# EAGLE design TVHR-PFG01 (EAGLE 6.0)
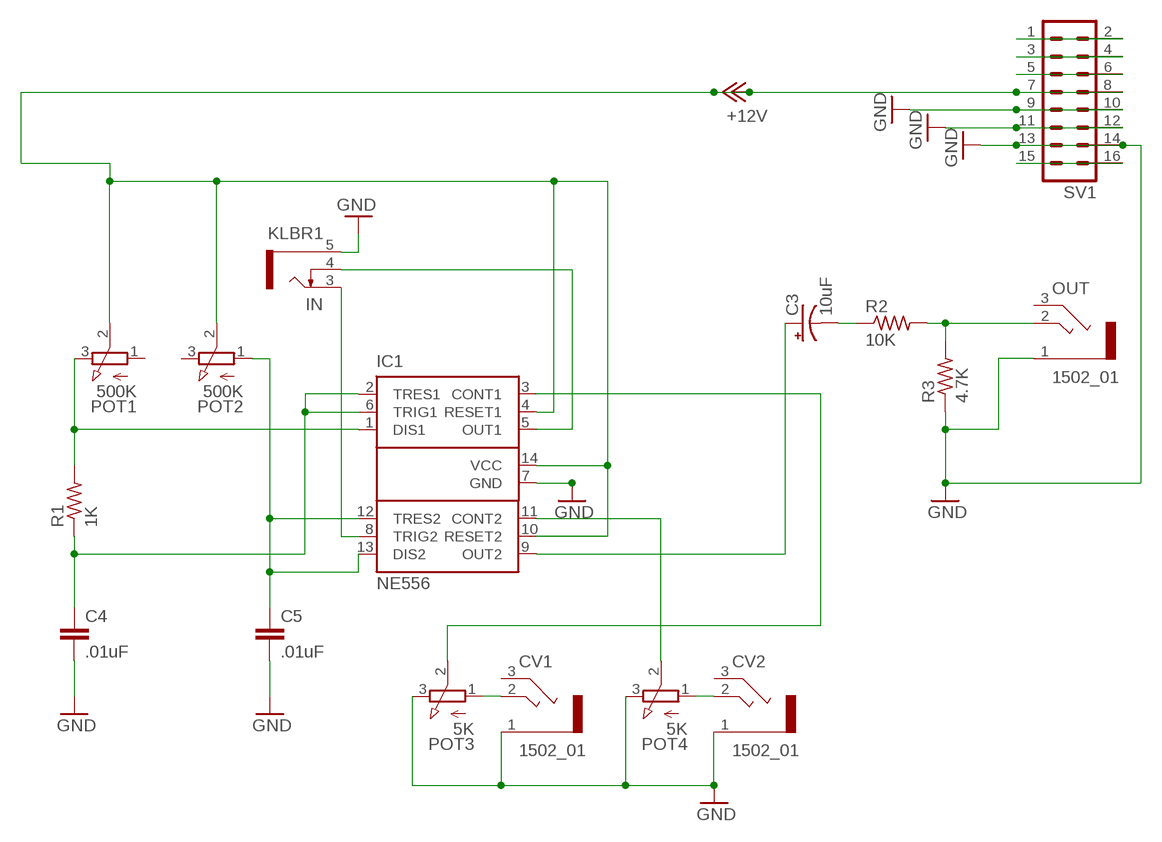
[diagram p0: schematic, sheet 1]

## Parts
C3  10uF  CPOL-USE2.5-5  [E2,5-5]
C4  .01uF  C2,5-3  [C2.5-3]
C5  .01uF  C2,5-3  [C2.5-3]
CV1  1502_01  [1502_01]
CV2  1502_01  [1502_01]
IC1  NE556  [DIL14]
IN  KLBR1  [KLBR1]
OUT  1502_01  [1502_01]
POT1  500K  3RP/1610N  [3RP/1610N]
POT2  500K  3RP/1610N  [3RP/1610N]
POT3  5K  3RP/1610N  [3RP/1610N]
POT4  5K  3RP/1610N  [3RP/1610N]
R1  1K  R-US_0204/7  [0204/7]
R2  10K  R-US_0204/7  [0204/7]
R3  4.7K  R-US_0204/7  [0204/7]
SV1  MA08-2  [MA08-2]

## Nets
+12V: IC1.4(RESET1) IC1.10(RESET2) IC1.14(VCC) POT1.2(S) POT2.2(S) SV1.7 SV1.8
GND: C4.2 C5.2 CV1.1 CV2.1 IC1.7(GND) IN.5 OUT.1 POT3.3(E) POT4.3(E) R3.1 SV1.9 SV1.10 SV1.11 SV1.12 SV1.13 SV1.14
N$1: SV1.1 SV1.2
N$2: IC1.1(DIS1) POT1.3(E) R1.2
N$3: C4.1 IC1.2(TRES1) IC1.6(TRIG1) R1.1
N$4: C5.1 IC1.12(TRES2) IC1.13(DIS2) POT2.1(A)
N$5: C3.- R2.1
N$6: IC1.5(OUT1) IN.4
N$7: C3.+ IC1.9(OUT2)
N$8: OUT.2 R2.2 R3.2
N$9: IC1.3(CONT1) POT3.2(S)
N$10: IC1.11(CONT2) POT4.2(S)
N$11: SV1.3 SV1.4
N$12: SV1.5 SV1.6
N$13: CV2.2 POT4.1(A)
N$15: CV1.2 POT3.1(A)
N$17: SV1.15 SV1.16
N$24: IC1.8(TRIG2) IN.3
Unconnected: CV1.3 CV2.3 OUT.3 POT1.1(A) POT2.3(E)

## Library data of the parts
C3 = rcl:CPOL-US: POLARIZED CAPACITOR, American symbol
C4 C5 = capacitor-wima:C: CAPACITOR naming: grid - package width
CV1 CV2 OUT = con-lumberg:1502_01: Jack connectors according to JISC 6560, 3.5 mm Klinkensteckverbinder nach JISC 6560, 3,5 mm Source: http://www.lumberg.com/Produkte/PDFs/1502_01.pdf; OC_FARNELL: 4739747; OC_NEWARK: unknown
IC1 = st-microelectronics:NE556: General Purpose Biopolartimer; MPN: NE556; OC_FARNELL: 2349784; OC_NEWARK: 83C0108
IN = con-lumberg:KLBR?: Jack connectors according to JISC 6560, 2.5mm / 3.5 mm Klinkensteckverbinder nach JISC 6560, 2.5mm / 3,5 mm Source: http://www.lumberg.com/Produkte/PDFs/KLBR2.pdf www.lumberg.com/Produkte/PDFs/KLBR1.pdf; MPN: KLBR 1; OC_FARNELL: 1200140; OC_NEWARK: 97K2707
POT1-POT4 = pot:3RP/1610N: 16mm Potentiometer one level Source: http://www.alphapotentiometers.net/html/16mm_pot_2.html
R1-R3 = rcl:R-US_: RESISTOR, American symbol
SV1 = con-lstb:MA08-2: PIN HEADER; OC_FARNELL: unknown; OC_NEWARK: unknown

## Board
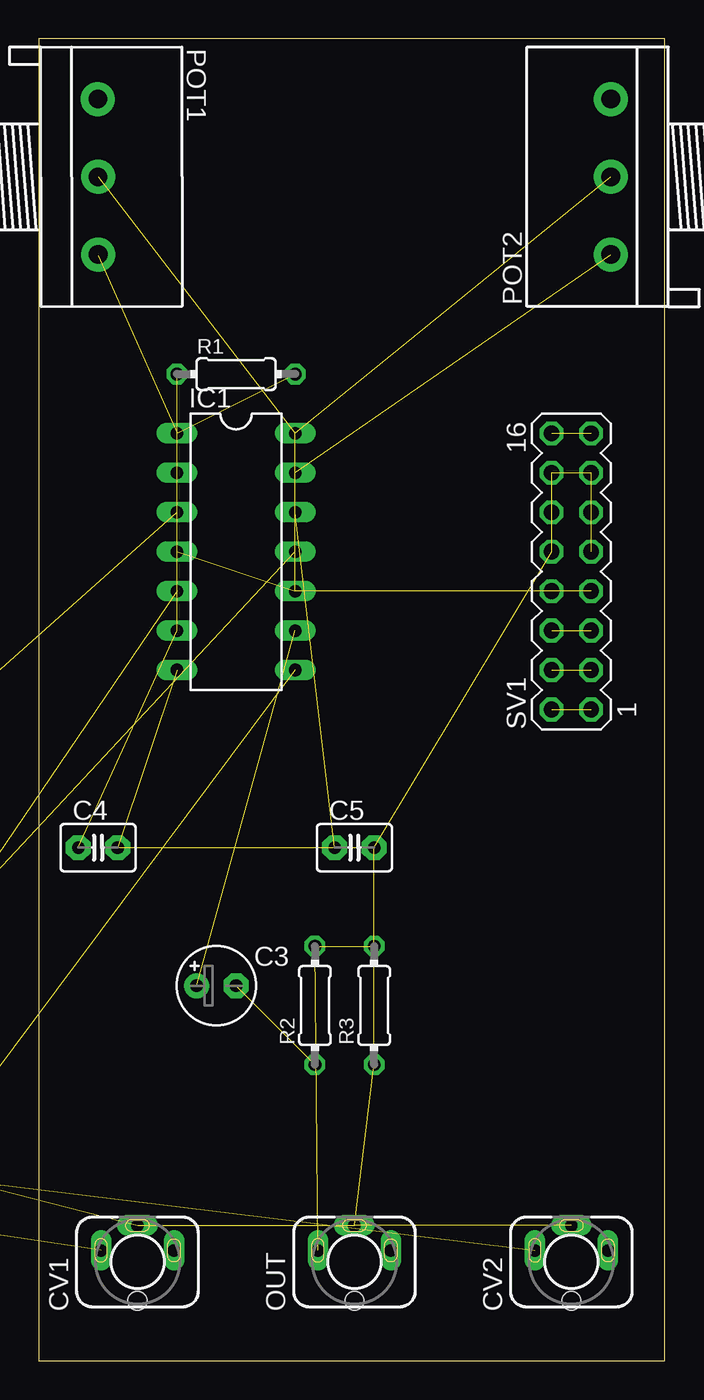
[diagram p1: board, top side]
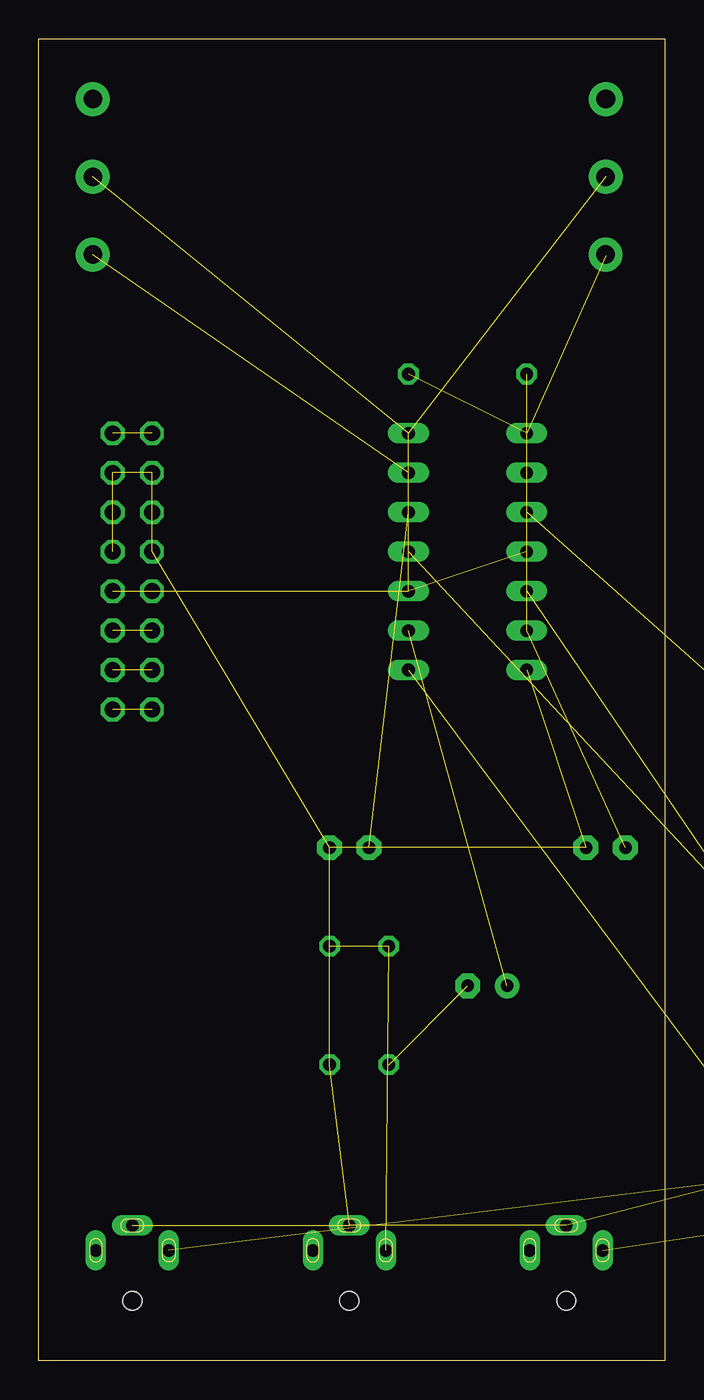
[diagram p2: board, bottom side, seen from below]

Size 40.31 x 85.08 mm. Coordinates in mm from the lower left corner, seen from the top.
Outline: 0,0 40.31,0 40.31,85.08 0,85.08 0,0
Copper layers (1*16): Top 0.035mm / dielectric 1.5mm / Bottom 0.035mm
Design rules: minimum track width 10mil, minimum drill 24mil, track to track 8mil, track to pad 8mil, pad to pad 8mil, via to via 8mil, smd to smd 8mil, copper to edge 40mil, drill to drill 8mil, minimum pad ring 10mil, minimum via ring 8mil, stop-mask expansion 4mil, vias tented up to drill 0mil, thermal gap 10mil

### Footprints (pad centres in the part's own frame; a part is rotated, then mirrored left to right if it is on the bottom)
E2,5-5 = drill 0.813 pad 1.6: + -1.27,0 | drill 0.813 pad 1.6 octagon: - 1.27,0
C2.5-3 = drill 0.813 pad 1.6 octagon: 1 -1.27,0; 2 1.27,0
1502_01 = drill 0.8 pad 1.2 long: 1 0,2.35; 2 -2.35,0.75; 3 2.35,0.75 | hole 1.2: 0,-2.5
DIL14 = drill 0.813 long: 1 -7.62,-3.81; 2 -5.08,-3.81; 3 -2.54,-3.81; 4 0,-3.81; 5 2.54,-3.81; 6 5.08,-3.81; 7 7.62,-3.81; 8 7.62,3.81; 9 5.08,3.81; 10 2.54,3.81; 11 0,3.81; 12 -2.54,3.81; 13 -5.08,3.81; 14 -7.62,3.81
KLBR1 = drill 1 pad 1.8 long: 3 0,-4.7; 4 -4,-3.5; 5 0,4.7
3RP/1610N = drill 1.2 pad 2.184: 1 -5,0; 2 0,0; 3 5,0
0204/7 = drill 0.813 octagon: 1 -3.81,0; 2 3.81,0
MA08-2 = drill 1.016 octagon: 1 -8.89,-1.27; 2 -8.89,1.27; 3 -6.35,-1.27; 4 -6.35,1.27; 5 -3.81,-1.27; 6 -3.81,1.27; 7 -1.27,-1.27; 8 -1.27,1.27; 9 1.27,-1.27; 10 1.27,1.27; 11 3.81,-1.27; 12 3.81,1.27; 13 6.35,-1.27; 14 6.35,1.27; 15 8.89,-1.27; 16 8.89,1.27

### Placement (x,y rotation side)
C3  11.43,24.13 0 top
C4  3.81,33.02 0 top
C5  20.32,33.02 0 top
CV1  6.35,6.35 0 top
CV2  34.29,6.35 0 top
IC1  12.7,52.07 270 top
IN  -53.34,-44.45 0 top  (outside the outline)
OUT  20.32,6.35 0 top
POT1  3.81,76.2 270.1 top
POT2  36.83,76.2 90 top
POT3  -36.83,13.97 0 top  (outside the outline)
POT4  -19.05,13.97 0 top  (outside the outline)
R1  12.7,63.5 0 top
R2  17.78,22.86 90 top
R3  21.59,22.86 90 top
SV1  34.29,50.8 90 top

### Tracks (layer width: path | path; a pad name or v marks a point on that pad's centre or on a via)
+12V  (6 unrouted)
GND  (15 unrouted)
N$1  (1 unrouted)
N$2  (2 unrouted)
  Bottom 0.254: 3.81,71.12 POT1.3
N$3  (3 unrouted)
N$4  (3 unrouted)
N$5  (1 unrouted)
N$6  (1 unrouted)
N$7  (1 unrouted)
N$8  (2 unrouted)
N$9  (1 unrouted)
N$10  (1 unrouted)
N$11  (1 unrouted)
N$12  (1 unrouted)
N$13  (1 unrouted)
N$15  (1 unrouted)
N$17  (1 unrouted)
N$24  (1 unrouted)